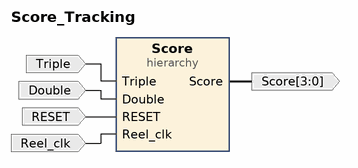
[diagram p0: block diagram of the top level]
# Vivado block design Score_Tracking, xc7a35tcpg236-1, Vivado 2018.3
create_bd_design Score_Tracking

create_bd_port -dir I Triple
create_bd_port -dir I Double
create_bd_port -dir I Reel_clk
create_bd_port -dir I RESET
create_bd_port -dir O -from 3 -to 0 Score

create_bd_cell -type hier Score

# ---- hierarchy /Score ----
current_bd_instance /Score
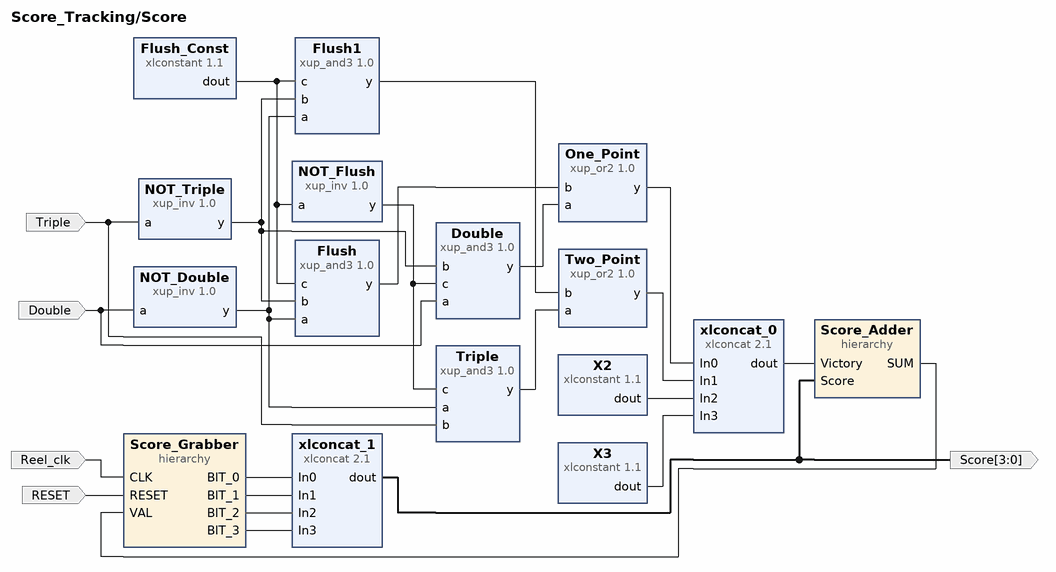
[diagram p1: block diagram inside /Score]
create_bd_pin -dir I Triple
create_bd_pin -dir I Double
create_bd_pin -dir O -from 3 -to 0 Score
create_bd_pin -dir I Reel_clk
create_bd_pin -dir I RESET

create_bd_cell -type ip -vlnv xilinx.com:xup:xup_inv:1.0 NOT_Triple
set_property -dict {CONFIG.DELAY 0} [get_bd_cells NOT_Triple]
create_bd_cell -type ip -vlnv xilinx.com:xup:xup_or2:1.0 Two_Point
set_property -dict {CONFIG.DELAY 0} [get_bd_cells Two_Point]
create_bd_cell -type ip -vlnv xilinx.com:ip:xlconstant:1.1 Flush_Const
set_property -dict {CONFIG.CONST_VAL 0} [get_bd_cells Flush_Const]
create_bd_cell -type ip -vlnv xilinx.com:xup:xup_inv:1.0 NOT_Double
set_property -dict {CONFIG.DELAY 0} [get_bd_cells NOT_Double]
create_bd_cell -type ip -vlnv xilinx.com:ip:xlconcat:2.1 xlconcat_0
set_property -dict {CONFIG.NUM_PORTS 4} [get_bd_cells xlconcat_0]
create_bd_cell -type ip -vlnv xilinx.com:ip:xlconcat:2.1 xlconcat_1
set_property -dict {CONFIG.NUM_PORTS 4} [get_bd_cells xlconcat_1]
create_bd_cell -type ip -vlnv xilinx.com:xup:xup_and3:1.0 Flush
create_bd_cell -type ip -vlnv xilinx.com:xup:xup_and3:1.0 Double
create_bd_cell -type ip -vlnv xilinx.com:xup:xup_inv:1.0 NOT_Flush
set_property -dict {CONFIG.DELAY 0} [get_bd_cells NOT_Flush]
create_bd_cell -type ip -vlnv xilinx.com:xup:xup_and3:1.0 Triple
create_bd_cell -type ip -vlnv xilinx.com:xup:xup_and3:1.0 Flush1
create_bd_cell -type ip -vlnv xilinx.com:ip:xlconstant:1.1 X2
set_property -dict {CONFIG.CONST_VAL 0} [get_bd_cells X2]
create_bd_cell -type ip -vlnv xilinx.com:ip:xlconstant:1.1 X3
set_property -dict {CONFIG.CONST_VAL 0} [get_bd_cells X3]
create_bd_cell -type ip -vlnv xilinx.com:xup:xup_or2:1.0 One_Point
set_property -dict {CONFIG.DELAY 0} [get_bd_cells One_Point]
create_bd_cell -type hier Score_Adder
create_bd_cell -type hier Score_Grabber

# ---- hierarchy /Score/Score_Adder ----
current_bd_instance /Score/Score_Adder
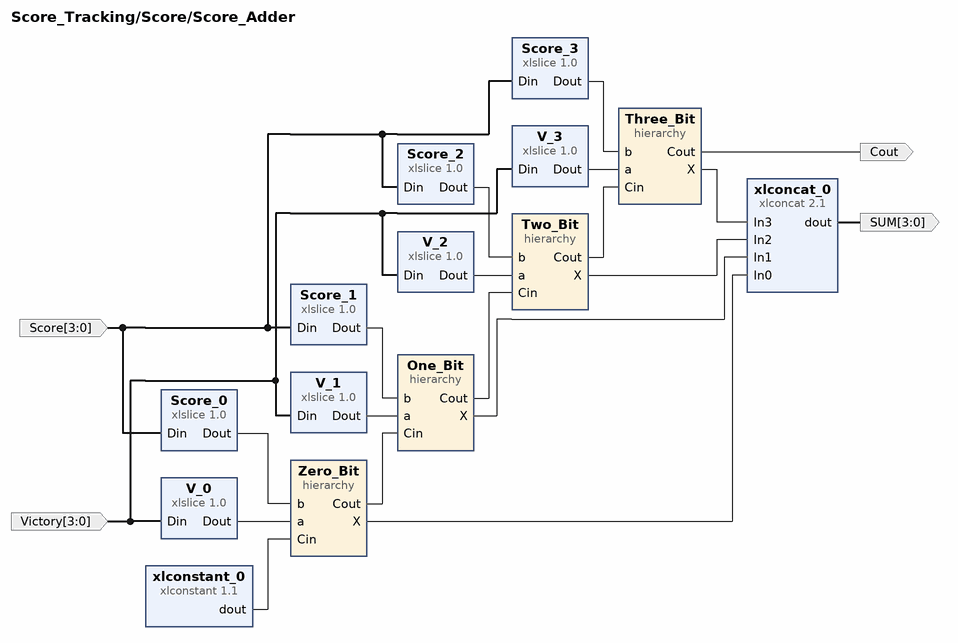
[diagram p2: block diagram inside /Score/Score_Adder]
create_bd_pin -dir I -from 3 -to 0 Score
create_bd_pin -dir O -from 3 -to 0 SUM
create_bd_pin -dir I -from 3 -to 0 Victory
create_bd_pin -dir O Cout

create_bd_cell -type ip -vlnv xilinx.com:ip:xlslice:1.0 Score_0
set_property -dict {CONFIG.DIN_FROM 0 CONFIG.DIN_TO 0 CONFIG.DIN_WIDTH 4} [get_bd_cells Score_0]
create_bd_cell -type ip -vlnv xilinx.com:ip:xlslice:1.0 Score_1
set_property -dict {CONFIG.DIN_FROM 1 CONFIG.DIN_TO 1 CONFIG.DIN_WIDTH 4 CONFIG.DOUT_WIDTH 1} [get_bd_cells Score_1]
create_bd_cell -type ip -vlnv xilinx.com:ip:xlconcat:2.1 xlconcat_0
set_property -dict {CONFIG.NUM_PORTS 4} [get_bd_cells xlconcat_0]
create_bd_cell -type ip -vlnv xilinx.com:ip:xlslice:1.0 Score_2
set_property -dict {CONFIG.DIN_FROM 2 CONFIG.DIN_TO 2 CONFIG.DIN_WIDTH 4 CONFIG.DOUT_WIDTH 1} [get_bd_cells Score_2]
create_bd_cell -type ip -vlnv xilinx.com:ip:xlconstant:1.1 xlconstant_0
set_property -dict {CONFIG.CONST_VAL 0} [get_bd_cells xlconstant_0]
create_bd_cell -type ip -vlnv xilinx.com:ip:xlslice:1.0 Score_3
set_property -dict {CONFIG.DIN_FROM 3 CONFIG.DIN_TO 3 CONFIG.DIN_WIDTH 4 CONFIG.DOUT_WIDTH 1} [get_bd_cells Score_3]
create_bd_cell -type ip -vlnv xilinx.com:ip:xlslice:1.0 V_0
set_property -dict {CONFIG.DIN_FROM 0 CONFIG.DIN_TO 0 CONFIG.DIN_WIDTH 4} [get_bd_cells V_0]
create_bd_cell -type ip -vlnv xilinx.com:ip:xlslice:1.0 V_1
set_property -dict {CONFIG.DIN_FROM 1 CONFIG.DIN_TO 1 CONFIG.DIN_WIDTH 4 CONFIG.DOUT_WIDTH 1} [get_bd_cells V_1]
create_bd_cell -type ip -vlnv xilinx.com:ip:xlslice:1.0 V_2
set_property -dict {CONFIG.DIN_FROM 2 CONFIG.DIN_TO 2 CONFIG.DIN_WIDTH 4 CONFIG.DOUT_WIDTH 1} [get_bd_cells V_2]
create_bd_cell -type ip -vlnv xilinx.com:ip:xlslice:1.0 V_3
set_property -dict {CONFIG.DIN_FROM 3 CONFIG.DIN_TO 3 CONFIG.DIN_WIDTH 4 CONFIG.DOUT_WIDTH 1} [get_bd_cells V_3]
create_bd_cell -type hier One_Bit
create_bd_cell -type hier Three_Bit
create_bd_cell -type hier Zero_Bit
create_bd_cell -type hier Two_Bit

# ---- hierarchy /Score/Score_Adder/One_Bit ----
current_bd_instance /Score/Score_Adder/One_Bit
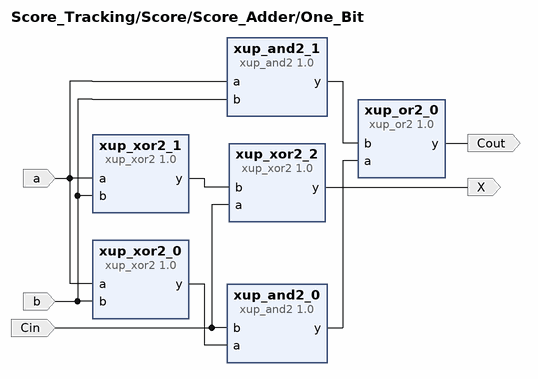
[diagram p3: block diagram inside /Score/Score_Adder/One_Bit]
create_bd_pin -dir I a
create_bd_pin -dir I b
create_bd_pin -dir I Cin
create_bd_pin -dir O X
create_bd_pin -dir O Cout

create_bd_cell -type ip -vlnv xilinx.com:xup:xup_xor2:1.0 xup_xor2_0
set_property -dict {CONFIG.DELAY 0} [get_bd_cells xup_xor2_0]
create_bd_cell -type ip -vlnv xilinx.com:xup:xup_xor2:1.0 xup_xor2_1
set_property -dict {CONFIG.DELAY 0} [get_bd_cells xup_xor2_1]
create_bd_cell -type ip -vlnv xilinx.com:xup:xup_xor2:1.0 xup_xor2_2
set_property -dict {CONFIG.DELAY 0} [get_bd_cells xup_xor2_2]
create_bd_cell -type ip -vlnv xilinx.com:xup:xup_and2:1.0 xup_and2_0
create_bd_cell -type ip -vlnv xilinx.com:xup:xup_and2:1.0 xup_and2_1
create_bd_cell -type ip -vlnv xilinx.com:xup:xup_or2:1.0 xup_or2_0
set_property -dict {CONFIG.DELAY 0} [get_bd_cells xup_or2_0]

# ---- hierarchy /Score/Score_Adder/Three_Bit ----
current_bd_instance /Score/Score_Adder/Three_Bit
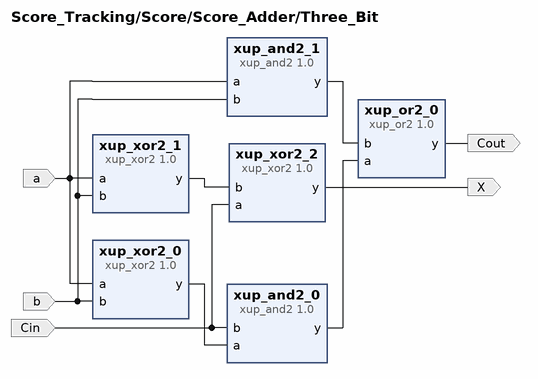
[diagram p4: block diagram inside /Score/Score_Adder/Three_Bit]
create_bd_pin -dir I a
create_bd_pin -dir I b
create_bd_pin -dir I Cin
create_bd_pin -dir O X
create_bd_pin -dir O Cout

create_bd_cell -type ip -vlnv xilinx.com:xup:xup_xor2:1.0 xup_xor2_0
set_property -dict {CONFIG.DELAY 0} [get_bd_cells xup_xor2_0]
create_bd_cell -type ip -vlnv xilinx.com:xup:xup_xor2:1.0 xup_xor2_1
set_property -dict {CONFIG.DELAY 0} [get_bd_cells xup_xor2_1]
create_bd_cell -type ip -vlnv xilinx.com:xup:xup_xor2:1.0 xup_xor2_2
set_property -dict {CONFIG.DELAY 0} [get_bd_cells xup_xor2_2]
create_bd_cell -type ip -vlnv xilinx.com:xup:xup_and2:1.0 xup_and2_0
create_bd_cell -type ip -vlnv xilinx.com:xup:xup_and2:1.0 xup_and2_1
create_bd_cell -type ip -vlnv xilinx.com:xup:xup_or2:1.0 xup_or2_0
set_property -dict {CONFIG.DELAY 0} [get_bd_cells xup_or2_0]

# ---- hierarchy /Score/Score_Adder/Zero_Bit ----
current_bd_instance /Score/Score_Adder/Zero_Bit
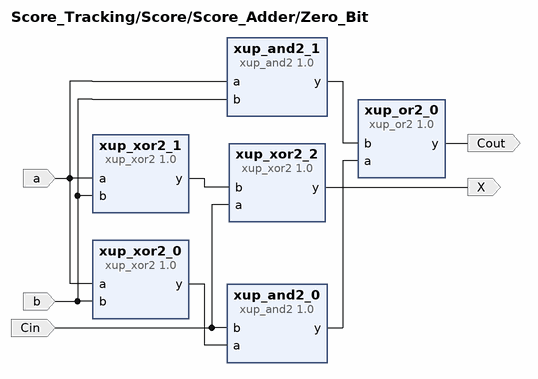
[diagram p5: block diagram inside /Score/Score_Adder/Zero_Bit]
create_bd_pin -dir I a
create_bd_pin -dir I b
create_bd_pin -dir I Cin
create_bd_pin -dir O X
create_bd_pin -dir O Cout

create_bd_cell -type ip -vlnv xilinx.com:xup:xup_xor2:1.0 xup_xor2_0
set_property -dict {CONFIG.DELAY 0} [get_bd_cells xup_xor2_0]
create_bd_cell -type ip -vlnv xilinx.com:xup:xup_xor2:1.0 xup_xor2_1
set_property -dict {CONFIG.DELAY 0} [get_bd_cells xup_xor2_1]
create_bd_cell -type ip -vlnv xilinx.com:xup:xup_xor2:1.0 xup_xor2_2
set_property -dict {CONFIG.DELAY 0} [get_bd_cells xup_xor2_2]
create_bd_cell -type ip -vlnv xilinx.com:xup:xup_and2:1.0 xup_and2_0
create_bd_cell -type ip -vlnv xilinx.com:xup:xup_and2:1.0 xup_and2_1
create_bd_cell -type ip -vlnv xilinx.com:xup:xup_or2:1.0 xup_or2_0
set_property -dict {CONFIG.DELAY 0} [get_bd_cells xup_or2_0]

# ---- hierarchy /Score/Score_Adder/Two_Bit ----
current_bd_instance /Score/Score_Adder/Two_Bit
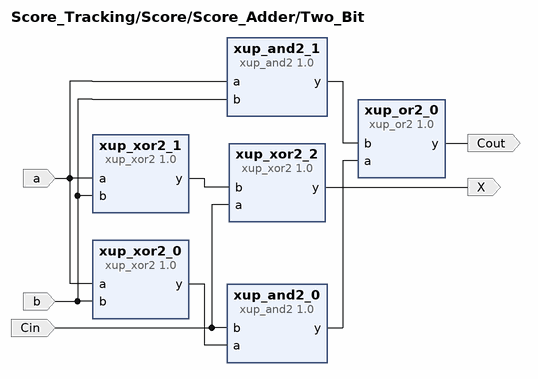
[diagram p6: block diagram inside /Score/Score_Adder/Two_Bit]
create_bd_pin -dir I a
create_bd_pin -dir I b
create_bd_pin -dir I Cin
create_bd_pin -dir O X
create_bd_pin -dir O Cout

create_bd_cell -type ip -vlnv xilinx.com:xup:xup_xor2:1.0 xup_xor2_0
set_property -dict {CONFIG.DELAY 0} [get_bd_cells xup_xor2_0]
create_bd_cell -type ip -vlnv xilinx.com:xup:xup_xor2:1.0 xup_xor2_1
set_property -dict {CONFIG.DELAY 0} [get_bd_cells xup_xor2_1]
create_bd_cell -type ip -vlnv xilinx.com:xup:xup_xor2:1.0 xup_xor2_2
set_property -dict {CONFIG.DELAY 0} [get_bd_cells xup_xor2_2]
create_bd_cell -type ip -vlnv xilinx.com:xup:xup_and2:1.0 xup_and2_0
create_bd_cell -type ip -vlnv xilinx.com:xup:xup_and2:1.0 xup_and2_1
create_bd_cell -type ip -vlnv xilinx.com:xup:xup_or2:1.0 xup_or2_0
set_property -dict {CONFIG.DELAY 0} [get_bd_cells xup_or2_0]

# ---- hierarchy /Score/Score_Grabber ----
current_bd_instance /Score/Score_Grabber
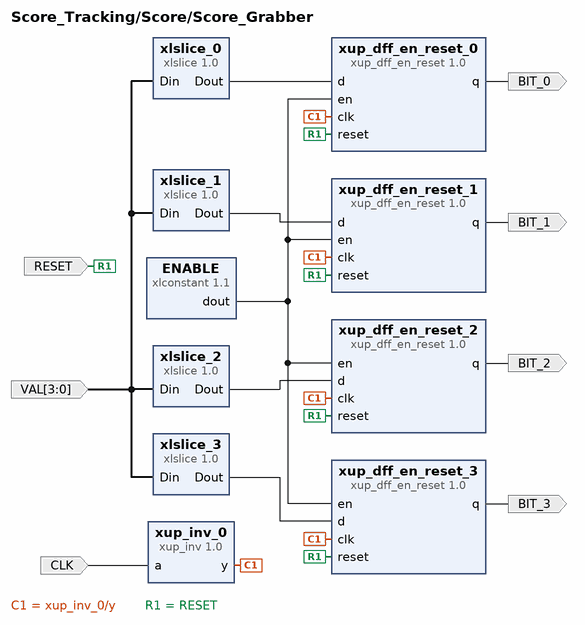
[diagram p7: block diagram inside /Score/Score_Grabber]
create_bd_pin -dir I CLK
create_bd_pin -dir I RESET
create_bd_pin -dir O BIT_0
create_bd_pin -dir I -from 3 -to 0 VAL
create_bd_pin -dir O BIT_1
create_bd_pin -dir O BIT_2
create_bd_pin -dir O BIT_3

create_bd_cell -type ip -vlnv xilinx.com:xup:xup_dff_en_reset:1.0 xup_dff_en_reset_0
set_property -dict {CONFIG.DELAY 0} [get_bd_cells xup_dff_en_reset_0]
create_bd_cell -type ip -vlnv xilinx.com:ip:xlslice:1.0 xlslice_0
set_property -dict {CONFIG.DIN_FROM 0 CONFIG.DIN_TO 0 CONFIG.DIN_WIDTH 4} [get_bd_cells xlslice_0]
create_bd_cell -type ip -vlnv xilinx.com:xup:xup_dff_en_reset:1.0 xup_dff_en_reset_1
set_property -dict {CONFIG.DELAY 0} [get_bd_cells xup_dff_en_reset_1]
create_bd_cell -type ip -vlnv xilinx.com:ip:xlslice:1.0 xlslice_1
set_property -dict {CONFIG.DIN_FROM 1 CONFIG.DIN_TO 1 CONFIG.DIN_WIDTH 4 CONFIG.DOUT_WIDTH 1} [get_bd_cells xlslice_1]
create_bd_cell -type ip -vlnv xilinx.com:xup:xup_dff_en_reset:1.0 xup_dff_en_reset_2
set_property -dict {CONFIG.DELAY 0} [get_bd_cells xup_dff_en_reset_2]
create_bd_cell -type ip -vlnv xilinx.com:ip:xlslice:1.0 xlslice_2
set_property -dict {CONFIG.DIN_FROM 2 CONFIG.DIN_TO 2 CONFIG.DIN_WIDTH 4 CONFIG.DOUT_WIDTH 1} [get_bd_cells xlslice_2]
create_bd_cell -type ip -vlnv xilinx.com:xup:xup_dff_en_reset:1.0 xup_dff_en_reset_3
set_property -dict {CONFIG.DELAY 0} [get_bd_cells xup_dff_en_reset_3]
create_bd_cell -type ip -vlnv xilinx.com:ip:xlslice:1.0 xlslice_3
set_property -dict {CONFIG.DIN_FROM 3 CONFIG.DIN_TO 3 CONFIG.DIN_WIDTH 4 CONFIG.DOUT_WIDTH 1} [get_bd_cells xlslice_3]
create_bd_cell -type ip -vlnv xilinx.com:xup:xup_inv:1.0 xup_inv_0
set_property -dict {CONFIG.DELAY 0} [get_bd_cells xup_inv_0]
create_bd_cell -type ip -vlnv xilinx.com:ip:xlconstant:1.1 ENABLE
set_property -dict {CONFIG.CONST_VAL 0} [get_bd_cells ENABLE]

# ---- connections ----

current_bd_instance /Score
connect_bd_net [get_bd_pins NOT_Triple/y] [get_bd_pins Double/b] [get_bd_pins Flush/b] [get_bd_pins Flush1/b]
connect_bd_net [get_bd_pins Triple/y] [get_bd_pins Two_Point/a]
connect_bd_net [get_bd_pins Flush1/y] [get_bd_pins Two_Point/b]
connect_bd_net -net xup_or2_1_y [get_bd_pins Two_Point/y] [get_bd_pins xlconcat_0/In1]
connect_bd_net -net xlconstant_0_dout [get_bd_pins Flush_Const/dout] [get_bd_pins NOT_Flush/a] [get_bd_pins Flush/c] [get_bd_pins Flush1/c]
connect_bd_net [get_bd_pins NOT_Double/y] [get_bd_pins Flush/a] [get_bd_pins Flush1/a] [get_bd_pins Triple/a]
connect_bd_net -net xup_or2_0_y [get_bd_pins One_Point/y] [get_bd_pins xlconcat_0/In0]
connect_bd_net [get_bd_pins X2/dout] [get_bd_pins xlconcat_0/In2]
connect_bd_net [get_bd_pins X3/dout] [get_bd_pins xlconcat_0/In3]
connect_bd_net [get_bd_pins xlconcat_0/dout] [get_bd_pins Score_Adder/Victory]
connect_bd_net [get_bd_pins Score_Grabber/BIT_0] [get_bd_pins xlconcat_1/In0]
connect_bd_net [get_bd_pins Score_Grabber/BIT_1] [get_bd_pins xlconcat_1/In1]
connect_bd_net [get_bd_pins Score_Grabber/BIT_2] [get_bd_pins xlconcat_1/In2]
connect_bd_net [get_bd_pins Score_Grabber/BIT_3] [get_bd_pins xlconcat_1/In3]
connect_bd_net [get_bd_pins Flush/y] [get_bd_pins One_Point/b]
connect_bd_net [get_bd_pins NOT_Flush/y] [get_bd_pins Double/c] [get_bd_pins Triple/c]
connect_bd_net [get_bd_pins Double/y] [get_bd_pins One_Point/a]
connect_bd_net [get_bd_pins Score_Adder/SUM] [get_bd_pins Score_Grabber/VAL]
connect_bd_net [get_bd_pins Triple] [get_bd_pins Triple/b] [get_bd_pins NOT_Triple/a]
connect_bd_net [get_bd_pins Double] [get_bd_pins Double/a] [get_bd_pins NOT_Double/a]
connect_bd_net [get_bd_pins xlconcat_1/dout] [get_bd_pins Score] [get_bd_pins Score_Adder/Score]
connect_bd_net [get_bd_pins Reel_clk] [get_bd_pins Score_Grabber/CLK]
connect_bd_net [get_bd_pins RESET] [get_bd_pins Score_Grabber/RESET]

current_bd_instance /Score/Score_Adder
connect_bd_net [get_bd_pins Score_0/Dout] [get_bd_pins Zero_Bit/b]
connect_bd_net [get_bd_pins Score_1/Dout] [get_bd_pins One_Bit/b]
connect_bd_net [get_bd_pins Zero_Bit/X] [get_bd_pins xlconcat_0/In0]
connect_bd_net [get_bd_pins One_Bit/X] [get_bd_pins xlconcat_0/In1]
connect_bd_net [get_bd_pins Two_Bit/X] [get_bd_pins xlconcat_0/In2]
connect_bd_net [get_bd_pins Three_Bit/X] [get_bd_pins xlconcat_0/In3]
connect_bd_net [get_bd_pins Score_2/Dout] [get_bd_pins Two_Bit/b]
connect_bd_net [get_bd_pins xlconstant_0/dout] [get_bd_pins Zero_Bit/Cin]
connect_bd_net [get_bd_pins Score_3/Dout] [get_bd_pins Three_Bit/b]
connect_bd_net [get_bd_pins V_0/Dout] [get_bd_pins Zero_Bit/a]
connect_bd_net [get_bd_pins V_1/Dout] [get_bd_pins One_Bit/a]
connect_bd_net [get_bd_pins V_2/Dout] [get_bd_pins Two_Bit/a]
connect_bd_net [get_bd_pins V_3/Dout] [get_bd_pins Three_Bit/a]
connect_bd_net [get_bd_pins Zero_Bit/Cout] [get_bd_pins One_Bit/Cin]
connect_bd_net [get_bd_pins One_Bit/Cout] [get_bd_pins Two_Bit/Cin]
connect_bd_net [get_bd_pins Two_Bit/Cout] [get_bd_pins Three_Bit/Cin]
connect_bd_net [get_bd_pins Score] [get_bd_pins Score_1/Din] [get_bd_pins Score_2/Din] [get_bd_pins Score_3/Din] [get_bd_pins Score_0/Din]
connect_bd_net [get_bd_pins xlconcat_0/dout] [get_bd_pins SUM]
connect_bd_net [get_bd_pins Victory] [get_bd_pins V_1/Din] [get_bd_pins V_2/Din] [get_bd_pins V_3/Din] [get_bd_pins V_0/Din]
connect_bd_net [get_bd_pins Three_Bit/Cout] [get_bd_pins Cout]

current_bd_instance /Score/Score_Adder/One_Bit
connect_bd_net [get_bd_pins xup_xor2_0/y] [get_bd_pins xup_and2_0/a]
connect_bd_net [get_bd_pins xup_xor2_1/y] [get_bd_pins xup_xor2_2/b]
connect_bd_net [get_bd_pins xup_and2_0/y] [get_bd_pins xup_or2_0/a]
connect_bd_net [get_bd_pins xup_and2_1/y] [get_bd_pins xup_or2_0/b]
connect_bd_net [get_bd_pins a] [get_bd_pins xup_xor2_1/a] [get_bd_pins xup_and2_1/a] [get_bd_pins xup_xor2_0/a]
connect_bd_net [get_bd_pins b] [get_bd_pins xup_xor2_1/b] [get_bd_pins xup_and2_1/b] [get_bd_pins xup_xor2_0/b]
connect_bd_net [get_bd_pins Cin] [get_bd_pins xup_and2_0/b] [get_bd_pins xup_xor2_2/a]
connect_bd_net [get_bd_pins xup_xor2_2/y] [get_bd_pins X]
connect_bd_net [get_bd_pins xup_or2_0/y] [get_bd_pins Cout]

current_bd_instance /Score/Score_Adder/Three_Bit
connect_bd_net [get_bd_pins xup_xor2_0/y] [get_bd_pins xup_and2_0/a]
connect_bd_net [get_bd_pins xup_xor2_1/y] [get_bd_pins xup_xor2_2/b]
connect_bd_net [get_bd_pins xup_and2_0/y] [get_bd_pins xup_or2_0/a]
connect_bd_net [get_bd_pins xup_and2_1/y] [get_bd_pins xup_or2_0/b]
connect_bd_net [get_bd_pins a] [get_bd_pins xup_xor2_1/a] [get_bd_pins xup_and2_1/a] [get_bd_pins xup_xor2_0/a]
connect_bd_net [get_bd_pins b] [get_bd_pins xup_xor2_1/b] [get_bd_pins xup_and2_1/b] [get_bd_pins xup_xor2_0/b]
connect_bd_net [get_bd_pins Cin] [get_bd_pins xup_and2_0/b] [get_bd_pins xup_xor2_2/a]
connect_bd_net [get_bd_pins xup_xor2_2/y] [get_bd_pins X]
connect_bd_net [get_bd_pins xup_or2_0/y] [get_bd_pins Cout]

current_bd_instance /Score/Score_Adder/Zero_Bit
connect_bd_net [get_bd_pins xup_xor2_0/y] [get_bd_pins xup_and2_0/a]
connect_bd_net [get_bd_pins xup_xor2_1/y] [get_bd_pins xup_xor2_2/b]
connect_bd_net [get_bd_pins xup_and2_0/y] [get_bd_pins xup_or2_0/a]
connect_bd_net [get_bd_pins xup_and2_1/y] [get_bd_pins xup_or2_0/b]
connect_bd_net [get_bd_pins a] [get_bd_pins xup_xor2_1/a] [get_bd_pins xup_and2_1/a] [get_bd_pins xup_xor2_0/a]
connect_bd_net [get_bd_pins b] [get_bd_pins xup_xor2_1/b] [get_bd_pins xup_and2_1/b] [get_bd_pins xup_xor2_0/b]
connect_bd_net [get_bd_pins Cin] [get_bd_pins xup_and2_0/b] [get_bd_pins xup_xor2_2/a]
connect_bd_net [get_bd_pins xup_xor2_2/y] [get_bd_pins X]
connect_bd_net [get_bd_pins xup_or2_0/y] [get_bd_pins Cout]

current_bd_instance /Score/Score_Adder/Two_Bit
connect_bd_net [get_bd_pins xup_xor2_0/y] [get_bd_pins xup_and2_0/a]
connect_bd_net [get_bd_pins xup_xor2_1/y] [get_bd_pins xup_xor2_2/b]
connect_bd_net [get_bd_pins xup_and2_0/y] [get_bd_pins xup_or2_0/a]
connect_bd_net [get_bd_pins xup_and2_1/y] [get_bd_pins xup_or2_0/b]
connect_bd_net [get_bd_pins a] [get_bd_pins xup_xor2_1/a] [get_bd_pins xup_and2_1/a] [get_bd_pins xup_xor2_0/a]
connect_bd_net [get_bd_pins b] [get_bd_pins xup_xor2_1/b] [get_bd_pins xup_and2_1/b] [get_bd_pins xup_xor2_0/b]
connect_bd_net [get_bd_pins Cin] [get_bd_pins xup_and2_0/b] [get_bd_pins xup_xor2_2/a]
connect_bd_net [get_bd_pins xup_xor2_2/y] [get_bd_pins X]
connect_bd_net [get_bd_pins xup_or2_0/y] [get_bd_pins Cout]

current_bd_instance /Score/Score_Grabber
connect_bd_net [get_bd_pins xlslice_0/Dout] [get_bd_pins xup_dff_en_reset_0/d]
connect_bd_net [get_bd_pins xlslice_1/Dout] [get_bd_pins xup_dff_en_reset_1/d]
connect_bd_net [get_bd_pins xlslice_2/Dout] [get_bd_pins xup_dff_en_reset_2/d]
connect_bd_net [get_bd_pins xlslice_3/Dout] [get_bd_pins xup_dff_en_reset_3/d]
connect_bd_net [get_bd_pins xup_inv_0/y] \
  [get_bd_pins xup_dff_en_reset_1/clk] [get_bd_pins xup_dff_en_reset_2/clk] [get_bd_pins xup_dff_en_reset_3/clk] \
  [get_bd_pins xup_dff_en_reset_0/clk]
connect_bd_net [get_bd_pins ENABLE/dout] \
  [get_bd_pins xup_dff_en_reset_1/en] [get_bd_pins xup_dff_en_reset_2/en] [get_bd_pins xup_dff_en_reset_3/en] \
  [get_bd_pins xup_dff_en_reset_0/en]
connect_bd_net [get_bd_pins RESET] \
  [get_bd_pins xup_dff_en_reset_1/reset] [get_bd_pins xup_dff_en_reset_2/reset] [get_bd_pins xup_dff_en_reset_3/reset] \
  [get_bd_pins xup_dff_en_reset_0/reset]
connect_bd_net [get_bd_pins xup_dff_en_reset_0/q] [get_bd_pins BIT_0]
connect_bd_net [get_bd_pins VAL] [get_bd_pins xlslice_1/Din] [get_bd_pins xlslice_2/Din] [get_bd_pins xlslice_3/Din] [get_bd_pins xlslice_0/Din]
connect_bd_net [get_bd_pins xup_dff_en_reset_1/q] [get_bd_pins BIT_1]
connect_bd_net [get_bd_pins xup_dff_en_reset_2/q] [get_bd_pins BIT_2]
connect_bd_net [get_bd_pins xup_dff_en_reset_3/q] [get_bd_pins BIT_3]
connect_bd_net [get_bd_pins CLK] [get_bd_pins xup_inv_0/a]

current_bd_instance /
connect_bd_net -net xlconcat_1_dout [get_bd_pins Score/Score] [get_bd_ports Score]
connect_bd_net [get_bd_ports Triple] [get_bd_pins Score/Triple]
connect_bd_net [get_bd_ports Double] [get_bd_pins Score/Double]
connect_bd_net [get_bd_ports RESET] [get_bd_pins Score/RESET]
connect_bd_net [get_bd_ports Reel_clk] [get_bd_pins Score/Reel_clk]

validate_bd_design
save_bd_design
